# Altium schematic sheet X-M3P1O5_led_V1.0.SchDoc
size 355 x 279 mm
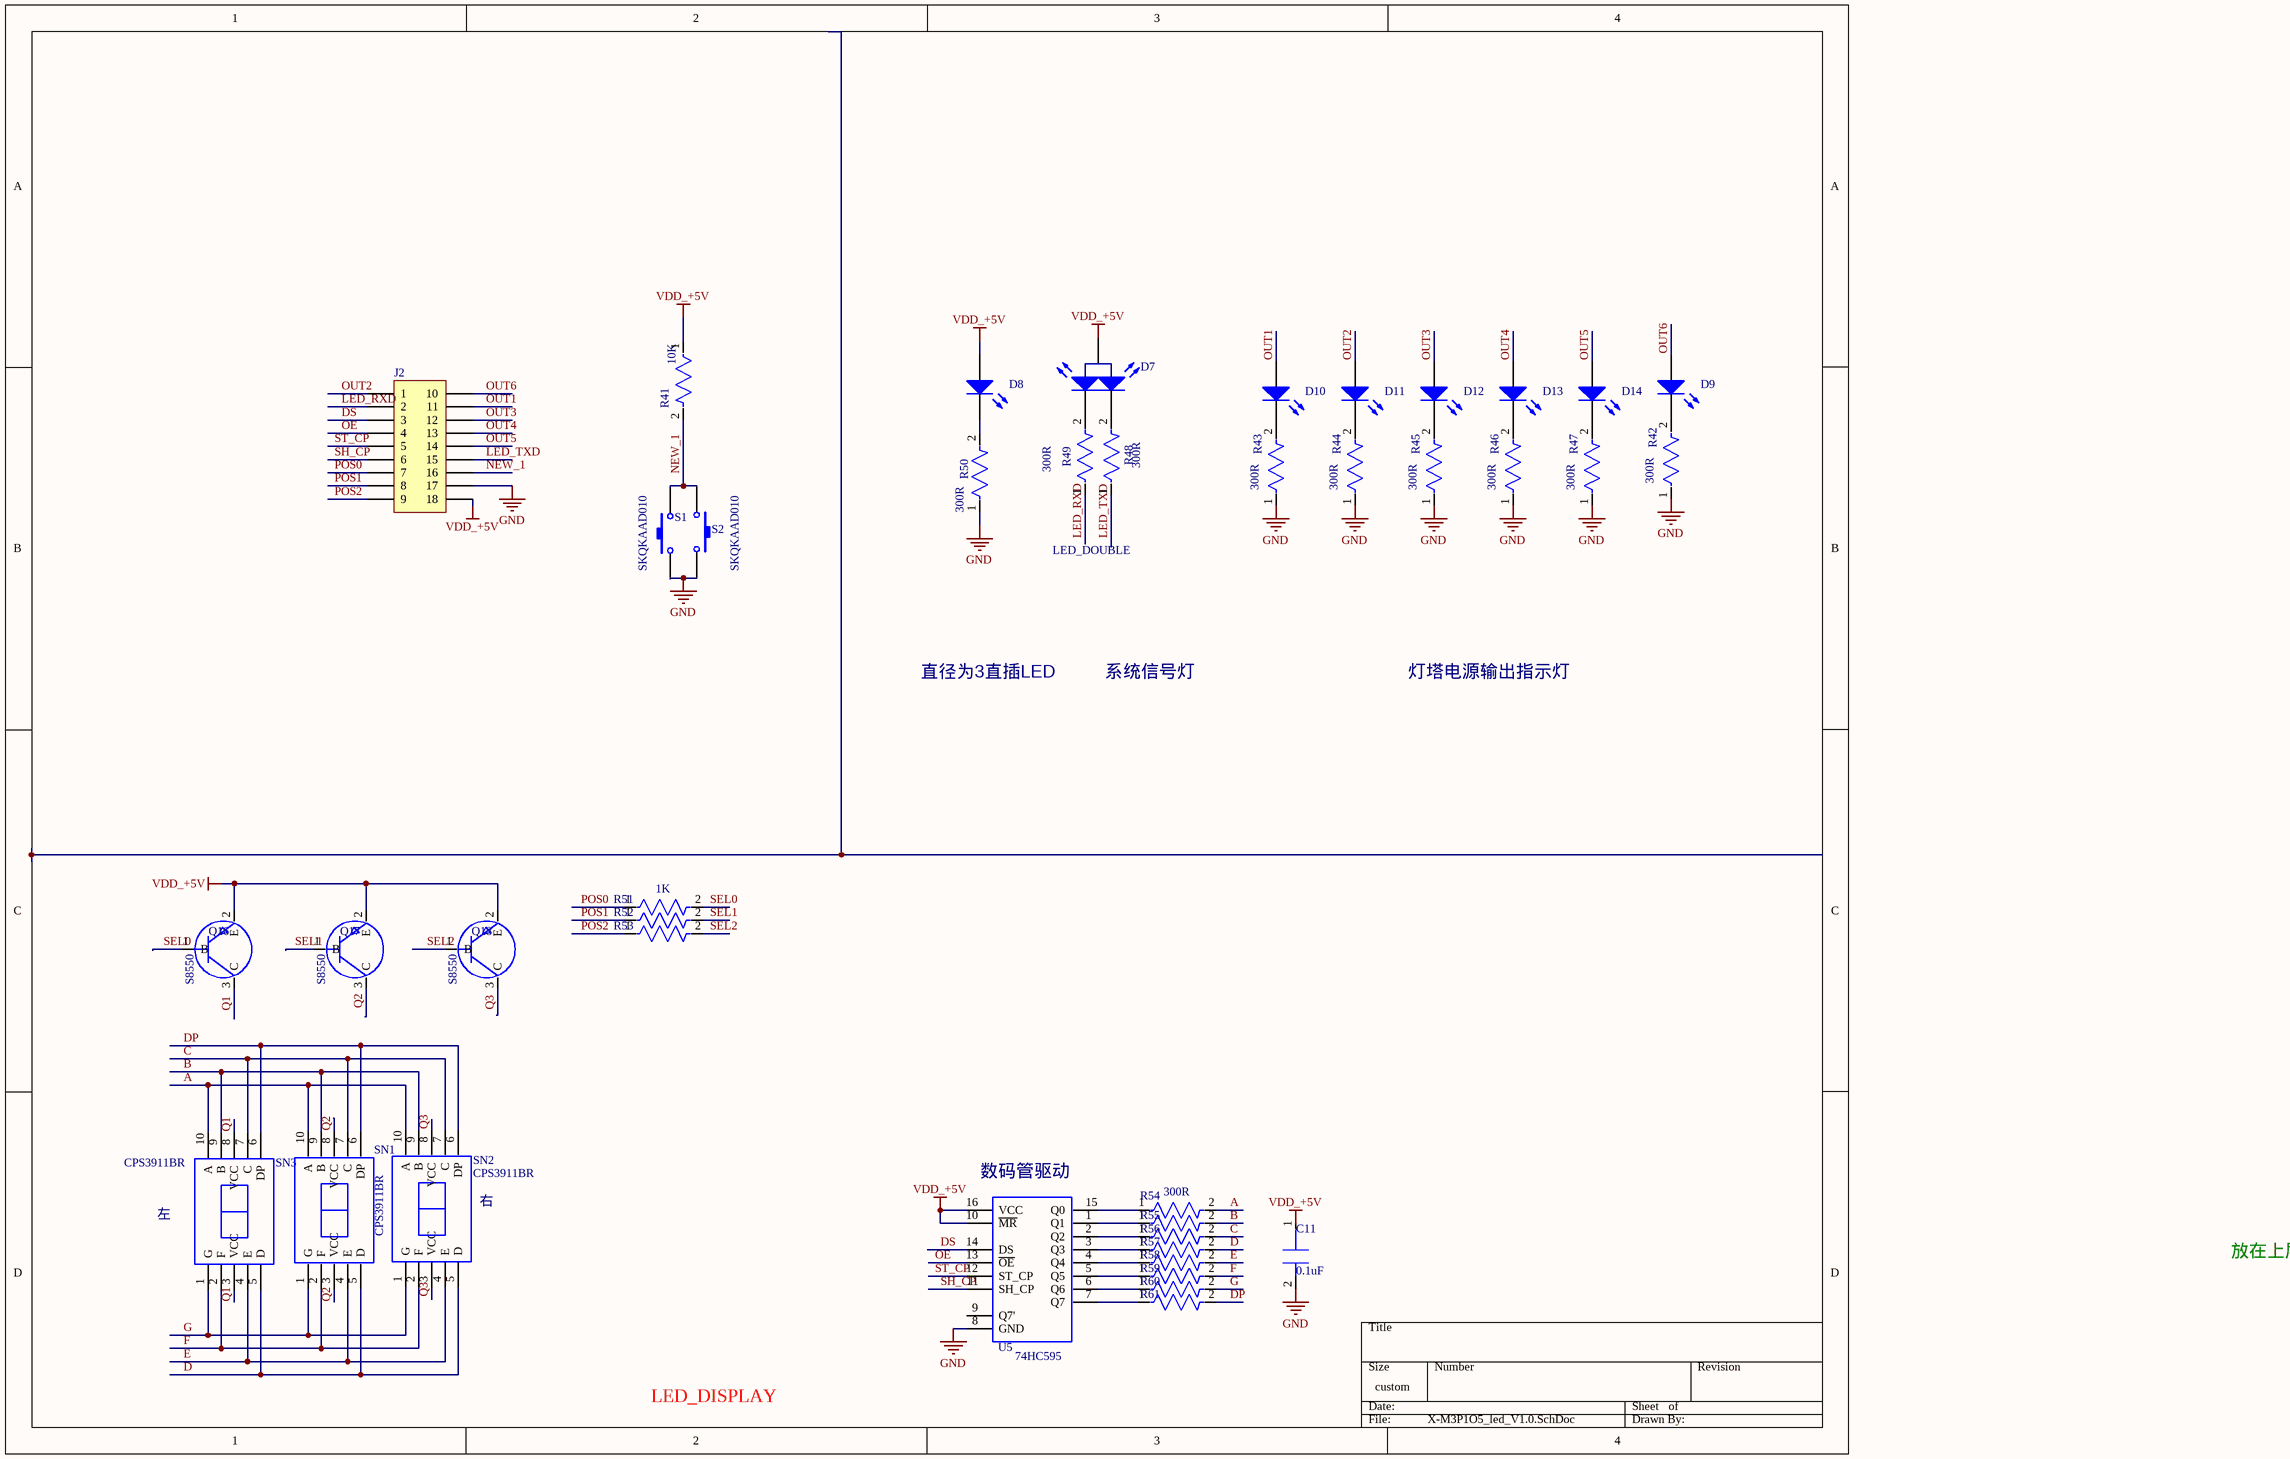
[diagram p0: X-M3P1O5_led_V1.0.SchDoc]

## Parts
C11  value 0.1uF  [C0603]  (hidden comment: 100nF/50V)
D7  LED_DOUBLE  [LED-2.54-3/DOUBLE]
D8  LED0  [LED-2.54-3]  (value not drawn)
D9  LED0  [LED-2.54-3]  (value not drawn)
D10  LED0  [LED-2.54-3]  (value not drawn)
D11  LED0  [LED-2.54-3]  (value not drawn)
D12  LED0  [LED-2.54-3]  (value not drawn)
D13  LED0  [LED-2.54-3]  (value not drawn)
D14  LED0  [LED-2.54-3]  (value not drawn)
J2  Header 9X2A  [HDR2X9_CEN]  (value not drawn)
Q16  S8550  [SOT-23]
Q17  S8550  [SOT-23]
Q18  S8550  [SOT-23]
R41  10K  [R0603]
R42  value 300R  [R0603]  (hidden comment: 20R)
R43  value 300R  [R0603]  (hidden comment: 20R)
R44  value 300R  [R0603]  (hidden comment: 20R)
R45  value 300R  [R0603]  (hidden comment: 20R)
R46  value 300R  [R0603]  (hidden comment: 20R)
R47  value 300R  [R0603]  (hidden comment: 20R)
R48  value 300R  [R0603]  (hidden comment: RES0603)
R49  value 300R  [R0603]  (hidden comment: RES0603)
R50  value 300R  [R0603]  (hidden comment: RES0603)
R51  1K  [R0603]
R52  1K  [R0603]  (value not drawn)
R53  1K  [R0603]  (value not drawn)
R54  value 300R  [R0603]  (hidden comment: 300)
R55  300  [R0603]  (value not drawn)
R56  300  [R0603]  (value not drawn)
R57  300  [R0603]  (value not drawn)
R58  300  [R0603]  (value not drawn)
R59  300  [R0603]  (value not drawn)
R60  300  [R0603]  (value not drawn)
R61  300  [R0603]  (value not drawn)
S1  SKQKAAD010  [SKQKAAD010]
S2  SKQKAAD010  [SKQKAAD010]
SN1  CPS3911BR  [shumaguan_10.16*7.62]
SN2  CPS3911BR  [shumaguan_10.16*7.62]
SN3  CPS3911BR  [shumaguan_10.16*7.62]
U5  74HC595  [SO-1.27-16/4.0]

## Nets
GND: C11.2 J2.17 R42.1 R43.1 R44.1 R45.1 R46.1 R47.1 R50.1 S1.1 S2.2 U5.8(GND)
VDD_+5V: C11.1 D7.2(K) D8.1(A) J2.18 Q16.2(E) Q17.2(E) Q18.2(E) R41.1 U5.10(~{MR}) U5.16(VCC)
A: R54.2 SN1.10(A) SN2.10(A) SN3.10(A)
B: R55.2 SN1.9(B) SN2.9(B) SN3.9(B)
C: R56.2 SN1.7(C) SN2.7(C) SN3.7(C)
D: R57.2 SN1.5(D) SN2.5(D) SN3.5(D)
DP: R61.2 SN1.6(DP) SN2.6(DP) SN3.6(DP)
DS: J2.3 U5.14(DS)
E: R58.2 SN1.4(E) SN2.4(E) SN3.4(E)
F: R59.2 SN1.2(F) SN2.2(F) SN3.2(F)
G: R60.2 SN1.1(G) SN2.1(G) SN3.1(G)
LED_RXD: J2.2 R49.1
LED_TXD: J2.15 R48.1
NEW_1: J2.16 R41.2 S1.2 S2.1
OE: J2.4 U5.13(~{OE})
OUT1: D10.1(A) J2.11
OUT2: D11.1(A) J2.1
OUT3: D12.1(A) J2.12
OUT4: D13.1(A) J2.13
OUT5: D14.1(A) J2.14
OUT6: D9.1(A) J2.10
POS0: J2.7 R51.1
POS1: J2.8 R52.1
POS2: J2.9 R53.1
Q1: Q16.3(C) SN3.3(VCC) SN3.8(VCC)
Q2: Q17.3(C) SN1.3(VCC) SN1.8(VCC)
Q3: Q18.3(C) SN2.3(VCC) SN2.8(VCC)
SEL0: Q16.1(B) R51.2
SEL1: Q17.1(B) R52.2
SEL2: Q18.1(B) R53.2
SH_CP: J2.6 U5.11(SH_CP)
ST_CP: J2.5 U5.12(ST_CP)
NetD7_1: D7.1(A) R49.2
NetD7_3: D7.3(A) R48.2
NetD8_2: D8.2(K) R50.2
NetD9_2: D9.2(K) R42.2
NetD10_2: D10.2(K) R43.2
NetD11_2: D11.2(K) R44.2
NetD12_2: D12.2(K) R45.2
NetD13_2: D13.2(K) R46.2
NetD14_2: D14.2(K) R47.2
NetR54_1: R54.1 U5.15(Q0)
NetR55_1: R55.1 U5.1(Q1)
NetR56_1: R56.1 U5.2(Q2)
NetR57_1: R57.1 U5.3(Q3)
NetR58_1: R58.1 U5.4(Q4)
NetR59_1: R59.1 U5.5(Q5)
NetR60_1: R60.1 U5.6(Q6)
NetR61_1: R61.1 U5.7(Q7)

Not connected (* = marked no-connect by the designer): U5 9(Q7')

## Notes on the sheet
- 直径为3直插LED
- 系统信号灯
- 灯塔电源输出指示灯
- (near SN3) 左
- (near SN2) 右
- (near U5) 数码管驱动
- 放在上层
- LED_DISPLAY

## Library data of the parts
C11 = CAP0603: SURFACE MOUNT CAPACITOR 0.031 X 0.061 INCHES; Manufacturer #1: IPC SM-782 STD.; Sim.Analog.Order: Model$; PCB DECAL: C0603
D7 = LED_DOUBLE: Typical INFRARED GaAs LED; Published: 8-Jun-2000; LatestRevisionDate: 08-Jul-2005; LatestRevisionNote: Mech Layer 1 removed.; PackageReference: LED-0; Publisher: Altium Limited
D8-D14 = LED0: Typical INFRARED GaAs LED; Published: 8-Jun-2000; LatestRevisionDate: 08-Jul-2005; LatestRevisionNote: Mech Layer 1 removed.; PackageReference: LED-0; Publisher: Altium Limited
J2 = Header 9X2A: Header, 9-Pin, Dual row; LatestRevisionDate: 17-Jul-2002; LatestRevisionNote: Re-released for DXP Platform.; Publisher: Altium Limited
Q16-Q18 = PNP(SOT-23): QUAD AMPLIFIER SWITCHING PNP SILICON TRANSISTOR; Manufacturer #1: MOTOROLA; Part Number: 2N3906; VALUE: FMMT593; PCB DECAL: SOT-23
R41-R54 = RES0603: SURFACE MOUNT RESISTOR 0.031 X 0.061 INCHES, 1/10W; Manufacturer #1: IPC SM-782 STD.; Sim.Analog.Prefix: R; Sim.Analog.Order: Model$; PCB DECAL: R0603
  R41: Value: 10K
  R51 R53: Value: 1K
  R52: Value: 1k
R55-R61 = RES0603: SURFACE MOUNT RESISTOR 0.031 X 0.061 INCHES, 1/10W; Manufacturer #1: IPC SM-782 STD.; Value: 150R; Sim.Analog.Prefix: R; Sim.Analog.Order: Model$; PCB DECAL: R0603
S1 S2 = SW-PB: Switch; Published: 24-Mar-1999; LatestRevisionDate: 17-Jul-2002; LatestRevisionNote: Re-released for DXP Platform.; PackageReference: SPST-2; Publisher: Altium Limited
SN1-SN3 = shumaguan13*10
U5 = 74HC595: VALUE: 74HC595; PCB DECAL: SO-1.27-16/4.0